# EAGLE design alfred_v2 (EAGLE 6.5.0)
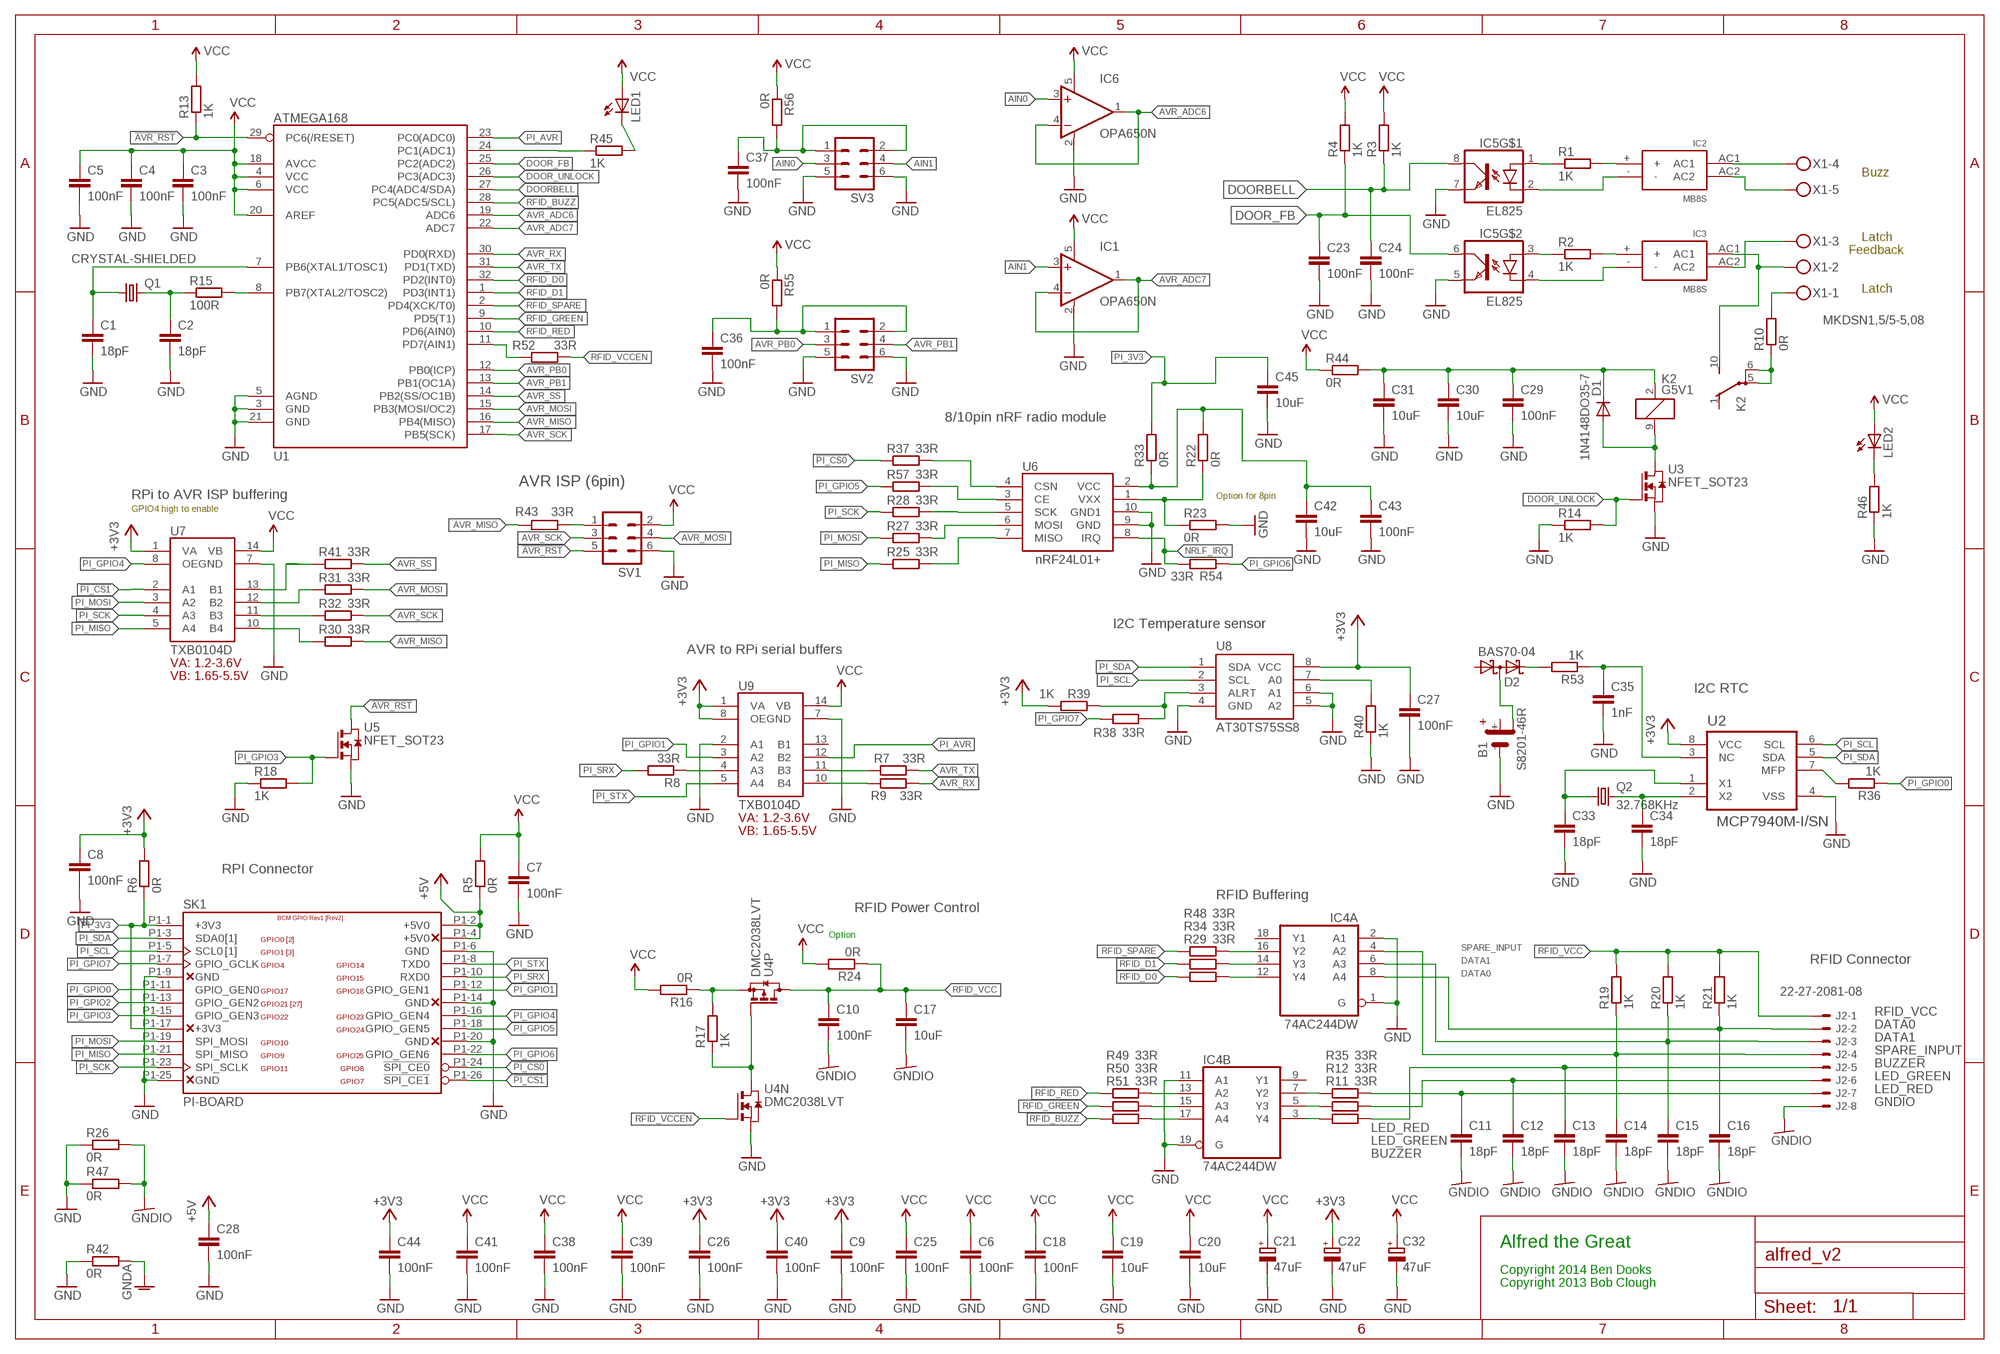
[diagram p0: schematic, sheet 1]

## Parts
B1  S8201-46R  [S8201-46R]
C1  18pF  C-EUC0603K  [C0603K]
C2  18pF  C-EUC0603K  [C0603K]
C3  100nF  C-EUC0603K  [C0603K]
C4  100nF  C-EUC0603K  [C0603K]
C5  100nF  C-EUC0603K  [C0603K]
C6  100nF  C-EUC0603K  [C0603K]
C7  100nF  C-EUC0603K  [C0603K]
C8  100nF  C-EUC0603K  [C0603K]
C9  100nF  C-EUC0603K  [C0603K]
C10  100nF  C-EUC0603K  [C0603K]
C11  18pF  C-EUC0603K  [C0603K]
C12  18pF  C-EUC0603K  [C0603K]
C13  18pF  C-EUC0603K  [C0603K]
C14  18pF  C-EUC0603K  [C0603K]
C15  18pF  C-EUC0603K  [C0603K]
C16  18pF  C-EUC0603K  [C0603K]
C17  10uF  C-EUC0805K  [C0805K]
C18  100nF  C-EUC0603K  [C0603K]
C19  10uF  C-EUC0805K  [C0805K]
C20  10uF  C-EUC0805K  [C0805K]
C21  47uF  CPOL-EUE2.5-7  [E2,5-7]
C22  47uF  CPOL-EUE2.5-7  [E2,5-7]
C23  100nF  C-EUC0603K  [C0603K]
C24  100nF  C-EUC0603K  [C0603K]
C25  100nF  C-EUC0603K  [C0603K]
C26  100nF  C-EUC0603K  [C0603K]
C27  100nF  C-EUC0603K  [C0603K]
C28  100nF  C-EUC0603K  [C0603K]
C29  100nF  C-EUC0603K  [C0603K]
C30  10uF  C-EUC0805K  [C0805K]
C31  10uF  C-EUC0805K  [C0805K]
C32  47uF  CPOL-EUE2.5-7  [E2,5-7]
C33  18pF  C-EUC0603K  [C0603K]
C34  18pF  C-EUC0603K  [C0603K]
C35  1nF  C-EUC0603K  [C0603K]
C36  100nF  C-EUC0603K  [C0603K]
C37  100nF  C-EUC0603K  [C0603K]
C38  100nF  C-EUC0603K  [C0603K]
C39  100nF  C-EUC0603K  [C0603K]
C40  100nF  C-EUC0603K  [C0603K]
C41  100nF  C-EUC0603K  [C0603K]
C42  10uF  C-EUC0805K  [C0805K]
C43  100nF  C-EUC0603K  [C0603K]
C44  100nF  C-EUC0603K  [C0603K]
C45  10uF  C-EUC0805K  [C0805K]
D1  1N4148DO35-7  [DO35-7]
D2  BAS70-04  [SOT23]
IC1  OPA650N  [SOT23-5]
IC2  MB8S  [MB8S]
IC3  MB8S  [MB8S]
IC4  74AC244DW  [SO20W]
IC5  EL825  [DIL08]
IC6  OPA650N  [SOT23-5]
J2  22-27-2081-08  [6410-08]
K2  G5V1  [G5V1]
LED1  LEDSML0805  [SML0805]
LED2  LEDSML0805  [SML0805]
Q1  CRYSTAL-SHIELDED  [SMX4]
Q2  32.768KHz  CRYSTALTC26H  [TC26H]
R1  1K  R-EU_R0603  [R0603]
R2  1K  R-EU_R0603  [R0603]
R3  1K  R-EU_R0603  [R0603]
R4  1K  R-EU_R0603  [R0603]
R5  0R  R-EU_R0603  [R0603]
R6  0R  R-EU_R0603  [R0603]
R7  33R  R-EU_R0603  [R0603]
R8  33R  R-EU_R0603  [R0603]
R9  33R  R-EU_R0603  [R0603]
R10  0R  R-EU_R0603  [R0603]
R11  33R  R-EU_R0603  [R0603]
R12  33R  R-EU_0204/5  [0204/5]
R13  1K  R-EU_R0603  [R0603]
R14  1K  R-EU_R0603  [R0603]
R15  100R  R-EU_R0603  [R0603]
R16  0R  R-EU_R0603  [R0603]
R17  1K  R-EU_R0603  [R0603]
R18  1K  R-EU_R0603  [R0603]
R19  1K  R-EU_0204/5  [0204/5]
R20  1K  R-EU_0204/5  [0204/5]
R21  1K  R-EU_0204/5  [0204/5]
R22  0R  R-EU_R0603  [R0603]
R23  0R  R-EU_R0603  [R0603]
R24  0R  R-EU_R0603  [R0603]
R25  33R  R-EU_R0603  [R0603]
R26  0R  R-EU_R0603  [R0603]
R27  33R  R-EU_R0603  [R0603]
R28  33R  R-EU_R0603  [R0603]
R29  33R  R-EU_0207/12  [0207/12]
R30  33R  R-EU_R0603  [R0603]
R31  33R  R-EU_R0603  [R0603]
R32  33R  R-EU_R0603  [R0603]
R33  0R  R-EU_R0603  [R0603]
R34  33R  R-EU_0207/12  [0207/12]
R35  33R  R-EU_0204/5  [0204/5]
R36  1K  R-EU_R0603  [R0603]
R37  33R  R-EU_R0603  [R0603]
R38  33R  R-EU_R0603  [R0603]
R39  1K  R-EU_R0603  [R0603]
R40  1K  R-EU_R0603  [R0603]
R41  33R  R-EU_R0603  [R0603]
R42  0R  R-EU_R0603  [R0603]
R43  33R  R-EU_R0603  [R0603]
R44  0R  R-EU_R0603  [R0603]
R45  1K  R-EU_R0603  [R0603]
R46  1K  R-EU_R0603  [R0603]
R47  0R  R-EU_R0603  [R0603]
R48  33R  R-EU_0207/12  [0207/12]
R49  33R  R-EU_0207/12  [0207/12]
R50  33R  R-EU_0207/12  [0207/12]
R51  33R  R-EU_0207/12  [0207/12]
R52  33R  R-EU_0207/12  [0207/12]
R53  1K  R-EU_R0603  [R0603]
R54  33R  R-EU_R0603  [R0603]
R55  0R  R-EU_R0603  [R0603]
R56  0R  R-EU_R0603  [R0603]
R57  33R  R-EU_R0603  [R0603]
SK1  PI-BOARD  [RASPBERRY-PI]
SV1  MA03-2  [MA03-2]
SV2  MA03-2  [MA03-2]
SV3  MA03-2  [MA03-2]
U1  ATMEGA168  [TQFP32-08]
U2  MCP7940M-I/SN  [SOIC127P600X175-8N]
U3  NFET_SOT23  [SOT23]
U4  DMC2038LVT  [TSOT26]
U5  NFET_SOT23  [SOT23]
U6  NRF24L01+CHINESE-10PIN  [CHINESE-10PIN]
U7  TXB0104D  [SO-14]
U8  AT30TS75SS8  [SOIC8]
U9  TXB0104D  [SO-14]
X1  MKDSN1,5/5-5,08  [MKDSN1,5/5-5,08]

## Nets
!AVR_RST: R13.1 SV1.5 U1.29(PC6(/RESET)) U5.3(D)
!NRLF_CE: R57.2 U6.3(CE)
!NRLF_CS: R37.2 U6.4(CSN)
!PI_CS0: R37.1 SK1.P1-24(!SPI_CE0)
!PI_CS1: SK1.P1-26(!SPI_CE1) U7.2(A1)
+3V3: C8.1 C9.1 C22.+ C26.1 C27.1 C40.1 C44.1 R6.2 R39.1 U2.8(VCC) U7.1(VA) U8.8(VCC) U9.1(VA) U9.8(OE)
+5V: C28.1 R5.1 SK1.P1-2(+5V0) SK1.P1-4(+5V0)
AIN0: IC6.3(+IN) SV3.3
AIN1: IC1.3(+IN) SV3.4
AVR_ADC6: IC6.1(OUT) IC6.4(-IN) U1.19(ADC6)
AVR_ADC7: IC1.1(OUT) IC1.4(-IN) U1.22(ADC7)
AVR_MISO: R30.2 R43.1 U1.16(PB4(MISO))
AVR_MOSI: R31.2 SV1.4 U1.15(PB3(MOSI/OC2))
AVR_PB0: SV2.3 U1.12(PB0(ICP))
AVR_PB1: SV2.4 U1.13(PB1(OC1A))
AVR_RX: R9.2 U1.30(PD0(RXD))
AVR_SCK: R32.2 SV1.3 U1.17(PB5(SCK))
AVR_SS: R41.2 U1.14(PB2(SS/OC1B))
AVR_TX: R7.2 U1.31(PD1(TXD))
BUZZER: C13.1 J2.5 R11.2
DATA0: C16.1 IC4.8(A:A4) J2.2 R21.1
DATA1: C15.1 IC4.6(A:A3) J2.3 R20.1
DOOR_FB: C23.1 IC5.6(COL) R4.1 U1.25(PC2(ADC2))
DOOR_UNLOCK: R14.2 U1.26(PC3(ADC3)) U3.1(G)
DOORBELL: C24.1 IC5.8(COL) R3.1 U1.27(PC4(ADC4/SDA))
GND: B1.- C1.2 C2.2 C3.2 C4.2 C5.2 C6.2 C7.2 C8.2 C9.2 C18.2 C19.2 C20.2 C21.- C22.- C23.2 C24.2 C25.2 C26.2 C27.2 C28.2 C29.2 C30.2 C31.2 C32.- C33.2 C34.2 C35.2 C36.2 C37.2 C38.2 C39.2 C40.2 C41.2 C42.2 C43.2 C44.2 C45.2 IC1.2(V-) IC4.1(A:G) IC4.2(A:A1) IC4.11(B:A1) IC4.19(B:G) IC5.5(EMIT) IC5.7(EMIT) IC6.2(V-) R14.1 R18.1 R23.2 R26.1 R40.1 R42.1 R46.1 R47.1 SK1.P1-6(GND) SK1.P1-9(GND) SK1.P1-14(GND) SK1.P1-20(GND) SK1.P1-25(GND) SV1.6 SV2.5 SV2.6 SV3.5 SV3.6 U1.3(GND) U1.5(AGND) U1.21(GND) U2.4(VSS) U3.2(S) U4.5(N:S) U5.2(S) U6.9(GND) U6.10(GND1) U7.7(GND) U8.4(GND) U8.5(A2) U8.6(A1) U9.2(A1) U9.7(GND)
GNDA: R42.2
GNDIO: C10.2 C11.2 C12.2 C13.2 C14.2 C15.2 C16.2 C17.2 J2.8 R26.2 R47.2
LED_GREEN: C12.1 J2.6 R12.2
LED_RED: C11.1 J2.7 R35.2
N$1: IC5.1(A) R1.1
N$2: IC2.- IC5.2(C)
N$3: IC2.+ R1.2
N$4: IC2.AC1 X1.4
N$5: IC2.AC2 X1.5
N$6: IC5.3(A) R2.1
N$7: IC3.+ R2.2
N$8: IC3.- IC5.4(C)
N$9: IC3.AC2 X1.3
N$10: R15.2 U1.8(PB7(XTAL2/TOSC2))
N$11: C1.1 Q1.3 U1.7(PB6(XTAL1/TOSC1))
N$12: C2.1 Q1.1 R15.1
N$13: IC3.AC1 K2.10(2:S) X1.2
N$14: R8.1 U9.4(A3)
N$15: R10.2 X1.1
N$16: D1.A K2.9 U3.3(D)
N$17: IC4.16(A:Y2) R48.2
N$18: K2.5(2:P) K2.6(2:P) R10.1
N$19: C35.1 R53.1 U2.3(NC)
N$20: D2.2(C2) R53.2
N$21: R43.2 SV1.1
N$22: R52.1 U1.11(PD7(AIN1))
N$23: B1.+1(+2) D2.3(C1A2)
N$24: IC4.14(A:Y3) R34.2
N$25: R30.1 U7.10(B4)
N$26: R36.2 U2.7(MFP)
N$27: R25.2 U6.7(MISO)
N$28: R38.2 R39.2 U8.3(ALRT)
N$29: R27.2 U6.6(MOSI)
N$30: R28.2 U6.5(SCK)
N$31: IC4.12(A:Y4) R29.2
N$32: IC4.17(B:A4) R51.2
N$33: R41.1 U7.13(B1)
N$35: C29.1 C30.1 C31.1 D1.C K2.2 R44.2
N$36: C33.1 Q2.1 U2.1(X1)
N$37: R45.1 U1.24(PC1(ADC1))
N$38: LED1.C R45.2
N$39: LED2.C R46.2
N$40: C34.1 Q2.2 U2.2(X2)
N$41: IC4.15(B:A3) R50.2
N$42: IC4.13(B:A2) R49.2
N$43: C36.1 R55.2 SV2.1 SV2.2
N$46: C37.1 R56.2 SV3.1 SV3.2
NRLF_IRQ: R54.2 U6.8(IRQ)
PI_3V3: C45.1 R6.1 R33.2 SK1.P1-1(+3V3) SK1.P1-17(+3V3)
PI_AVR: U1.23(PC0(ADC0)) U9.12(B2)
PI_GPIO0: R36.1 SK1.P1-11(GPIO_GEN0)
PI_GPIO1: SK1.P1-12(GPIO_GEN1) U9.3(A2)
PI_GPIO2: SK1.P1-13(GPIO_GEN2)
PI_GPIO3: R18.2 SK1.P1-15(GPIO_GEN3) U5.1(G)
PI_GPIO4: SK1.P1-16(GPIO_GEN4) U7.8(OE)
PI_GPIO5: R57.1 SK1.P1-18(GPIO_GEN5)
PI_GPIO6: R54.1 SK1.P1-22(GPIO_GEN6)
PI_GPIO7: R38.1 SK1.P1-7(GPIO_GCLK)
PI_MISO: R25.1 SK1.P1-21(SPI_MISO) U7.5(A4)
PI_MOSI: R27.1 SK1.P1-19(SPI_MOSI) U7.3(A2)
PI_SCK: R28.1 SK1.P1-23(SPI_SCLK) U7.4(A3)
PI_SCL: SK1.P1-5(SCL0) U2.6(SCL) U8.2(SCL)
PI_SDA: SK1.P1-3(SDA0) U2.5(SDA) U8.1(SDA)
PI_SRX: R8.2 SK1.P1-10(RXD0)
PI_STX: SK1.P1-8(TXD0) U9.5(A4)
R_BUZZER: IC4.3(B:Y4) R11.1
R_GREEN: IC4.5(B:Y3) R12.1
R_RED: IC4.7(B:Y2) R35.1
RF_VCC: C42.1 C43.1 R22.2 R33.1 U6.2(VCC)
RF_VXX: R22.1 R23.1 U6.1(VXX)
RFID_BUZZ: R51.1 U1.28(PC5(ADC5/SCL))
RFID_D0: R29.1 U1.32(PD2(INT0))
RFID_D1: R34.1 U1.1(PD3(INT1))
RFID_GREEN: R50.1 U1.9(PD5(T1))
RFID_RED: R49.1 U1.10(PD6(AIN0))
RFID_SPARE: R48.1 U1.2(PD4(XCK/T0))
RFID_SW: R17.1 U4.3(P:G) U4.6(N:D)
RFID_VCC: C10.1 C17.1 J2.1 R19.2 R20.2 R21.2 R24.1 U4.4(P:D)
RFID_VCCEN: R52.2 U4.1(N:G)
RFID_VCCSU: R16.1 R17.2 U4.2(P:S)
S_RX: R7.1 U9.11(B3)
S_RX1: R32.1 U7.11(B3)
S_TX: R9.1 U9.10(B4)
S_TX1: R31.1 U7.12(B2)
SPARE_INPUT: C14.1 IC4.4(A:A2) J2.4 R19.1
TMP_A0: R40.2 U8.7(A0)
VCC: C3.1 C4.1 C5.1 C6.1 C7.1 C18.1 C19.1 C20.1 C21.+ C25.1 C32.+ C38.1 C39.1 C41.1 IC1.5(V+) IC6.5(V+) LED1.A LED2.A R3.2 R4.2 R5.2 R13.2 R16.2 R24.2 R44.1 R55.1 R56.1 SV1.2 U1.4(VCC) U1.6(VCC) U1.18(AVCC) U1.20(AREF) U7.14(VB) U9.14(VB)
Unconnected: B1.+ D2.1(A1) IC4.9(B:Y1) IC4.18(A:Y1) K2.1(2:O) U9.13(B1)

## Notes on the sheet
- Buzz
- Latch
- Feedback
- Latch
- 8/10pin nRF radio module
- AVR ISP (6pin)
- RPi to AVR ISP buffering | Option for 8pin
- GPIO4 high to enable
- I2C Temperature sensor
- AVR to RPi serial buffers
- I2C RTC
- RPI Connector
- RFID Buffering
- RFID Power Control
- Option
- RFID Connector
- Alfred the Great
- Copyright 2014 Ben Dooks
- Copyright 2013 Bob Clough

## Power pins joined to a net without a drawn wire
GND: IC4.10(P:GND) Q1.2(GND) Q1.4(GND)
VCC: IC4.20(P:VCC)

## Library data of the parts
B1 = bjd-harwin-s8201-46r:S8201-46R
C1-C16 C18 C23-C29 C33-C41 C43 C44 = rcl:C-EU: CAPACITOR, European symbol
C17 C19 C20 C30 C31 C42 C45 = resistor:C-EU: CAPACITOR, European symbol
C21 C22 C32 = rcl:CPOL-EU: POLARIZED CAPACITOR, European symbol
D1 = diode:1N4148: DIODE high speed (Philips)
D2 = diode:BAS70-04: Silicon Schottky Diodes General-purpose diode for high-speed switching
IC1 IC6 = burr-brown:OPA650: Operational Amplifier Wideband, Low Power, Voltage Feedback; OC_FARNELL: unknown; OC_NEWARK: unknown
IC2 IC3 = bjd-multicomp-mb8s:MB8S
IC4 = 74xx-eu:74*244: Octal BUFFER and LINE DRIVER, 3-state
IC5 = bjd-opto-el825:EL825
J2 = con-molex:22-?-08: CONNECTOR wire to board 2.54 mm (.1 inch) pitch header; OC_FARNELL: unknown; OC_NEWARK: unknown
K2 = relay:G5V1: RELAY 1 x switch, 0.5 A/125 V AC, 1 A/24 V DC , Omron; MPN: G5V-1-DC24; OC_FARNELL: 9949593; OC_NEWARK: 36M6377
LED1 LED2 = led:LED: LED OSRAM: - CHIPLED LG R971, LG N971, LY N971, LG Q971, LY Q971, LO R971, LY R971 LH N974, LH R974 LS Q976, LO Q976, LY Q976 LO Q996 - Hyper CHIPLED LW Q18S LB Q993, LB Q99A, LB R99A - SideLED LS A670, LO A670, LY A670, LG A670, LP A670 LB A673, LV A673, LT A673, LW A673 LH A674 LY A675 LS A676, LA A676, LO A676, LY A676, LW A676 LS A679, LY A679, LG A679 - Hyper Micro SIDELED® LS Y876, LA Y876, LO Y876, LY Y876 LT Y87S - SmartLED LW L88C, LW L88S LB L89C, LB L89S, LG L890 LS L89K, LO L89K, LY L89K LS L896, LA L896, LO L896, LY L896 - TOPLED LS T670, LO T670, LY T670, LG T670, LP T670 LSG T670, LSP T670, LSY T670, LOP T670, LYG T670 LG T671, LOG T671, LSG T671 LB T673, LV T673, LT T673, LW T673 LH T674 LS T676, LA T676, LO T676, LY T676, LB T676, LH T676, LSB T676, LW T676 LB T67C, LV T67C, LT T67C, LS T67K, LO T67K, LY T67K, LW E67C LS E67B, LA E67B, LO E67B, LY E67B, LB E67C, LV E67C, LT E67C LW T67C LS T679, LY T679, LG T679 LS T770, LO T770, LY T770, LG T770, LP T770 LB T773, LV T773, LT T773, LW T773 LH T774 LS E675, LA E675, LY E675, LS T675 LS T776, LA T776, LO T776, LY T776, LB T776 LHGB T686 LT T68C, LB T68C - Hyper Mini TOPLED® LB M676 - Mini TOPLED Santana® LG M470 LS M47K, LO M47K, LY M47K Source: http://www.osram.convergy.de LUXEON: - LUMILED® LXK2-PW12-R00, LXK2-PW12-S00, LXK2-PW14-U00, LXK2-PW14-V00 LXK2-PM12-R00, LXK2-PM12-S00, LXK2-PM14-U00 LXK2-PE12-Q00, LXK2-PE12-R00, LXK2-PE12-S00, LXK2-PE14-T00, LXK2-PE14-U00 LXK2-PB12-K00, LXK2-PB12-L00, LXK2-PB12-M00, LXK2-PB14-N00, LXK2-PB14-P00, LXK2-PB14-Q00 LXK2-PR12-L00, LXK2-PR12-M00, LXK2-PR14-Q00, LXK2-PR14-R00 LXK2-PD12-Q00, LXK2-PD12-R00, LXK2-PD12-S00 LXK2-PH12-R00, LXK2-PH12-S00 LXK2-PL12-P00, LXK2-PL12-Q00, LXK2-PL12-R00 Source: www.luxeon.com KINGBRIGHT: KA-3528ASYC Source: www.kingbright.com
Q1 = bjd-crystals:CRYSTAL-SHIELDED
Q2 = crystal:CRYSTAL: CRYSTAL; OC_FARNELL: unknown; OC_NEWARK: unknown
R1-R57 = rcl:R-EU_: RESISTOR, European symbol
SK1 = jt-raspberry-pi:PI-: Raspberry Pi
SV1-SV3 = con-lstb:MA03-2: PIN HEADER; OC_FARNELL: unknown; OC_NEWARK: unknown
U1 = SparkFun:ATMEGA168
U2 = mcp7940m:MCP7940M-I/SN: RTC, I2C, 64BYTES SRAM, 8SOIC; MPN: MCP7940M-I/SN; OC_FARNELL: 2098890; OC_NEWARK: 79T6324; PACKAGE: SOIC-8; SUPPLIER: Microchip
U3 U5 = bjd-generic-fets:NFET_SOT23
U4 = bjd-diodes-dmc2038lvt:DMC2038LVT: DMC2038LVT N-P complementary FET See http://www.diodes.com/datasheets/DMC2038LVT.pdf
U6 = bjd-nrlf24+:NRF24L01+: When using the DUAL version of this library, make sure to connect VXX to either GND or NC
U7 U9 = bjd-txb0104:TXB0104
U8 = bjd-atmel-at30ts75:AT30TS75
X1 = con-phoenix-508:MKDSN1,5/5-5,08: MKDSN 1,5/ 5-5,08 Printklemme Nennstrom: 13,5 A Nennspannung: 250 V Rastermaß: 5,08 mm Polzahl: 5 Anschlussart: Schraubanschluss Montage: Löten Anschlussrichtung Leiter/Platine: 0 ° Artikelnummer: 1729157 Source: http://eshop.phoenixcontact.com .. 1729157.pdf; MPN: SMKDSN1,5/5-5,08; OC_FARNELL: 1792906; OC_NEWARK: 70R0301

## Board
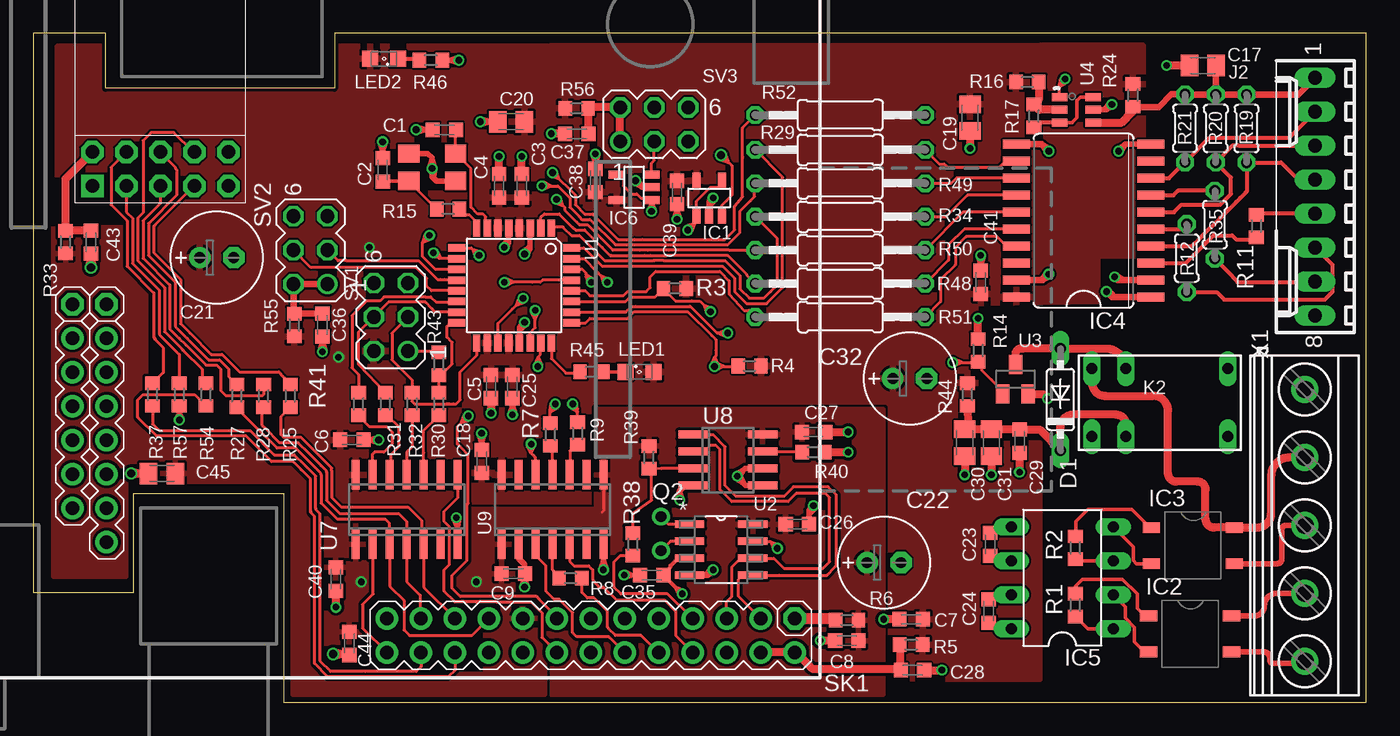
[diagram p1: board, top side]
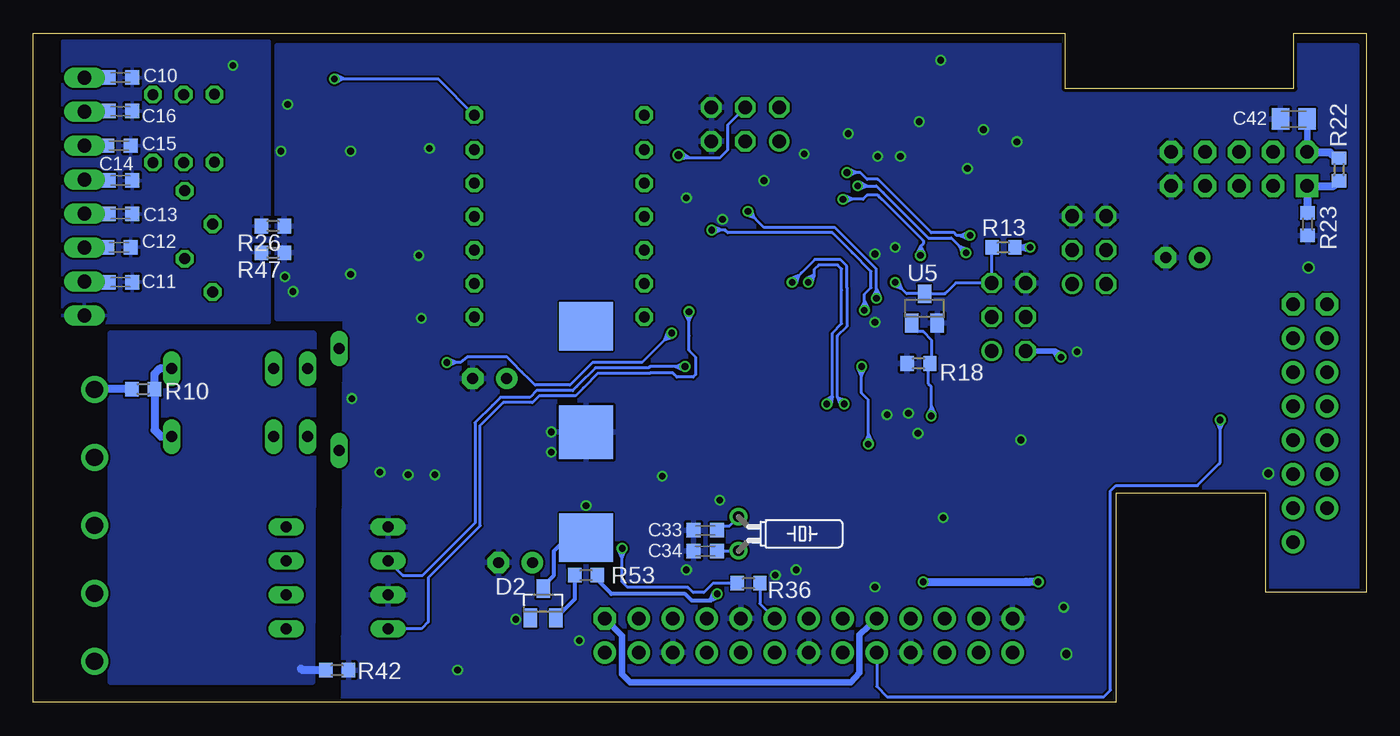
[diagram p2: board, bottom side, seen from below]

Size 99.6 x 50 mm. Coordinates in mm from the lower left corner, seen from the top.
Outline: 0,8.2 7.5,8.2 7.5,15.6 18.7,15.6 18.7,0 99.6,0 99.6,50 22.5,50 22.5,45.9 5.4,45.9 5.4,50 0,50 0,8.2
Copper layers (1*16): Top 0.035mm / dielectric 1.5mm / Bottom 0.035mm
Design rules "Elecrow_2-layer_eagle_rule *": minimum track width 6mil, minimum drill 12mil, track to track 6mil, track to pad 6mil, pad to pad 6mil, via to via 6mil, smd to smd 0mil, copper to edge 10mil, drill to drill 10mil, minimum pad ring 10mil, minimum via ring 6mil, stop-mask expansion 2mil, vias tented up to drill 100mil, thermal gap 8mil

### Footprints (pad centres in the part's own frame; a part is rotated, then mirrored left to right if it is on the bottom)
S8201-46R = smd 3.6 x 4: + -7.9,0; +1 7.9,0 | smd 4 x 4: - 0,0
C0603K = smd 1.05 x 1.08: 1 -0.875,0; 2 0.875,0
C0805K = smd 1.3 x 1.6: 1 -1,0; 2 1,0
E2,5-7 = drill 0.813 pad 1.6: + -1.27,0 | drill 0.813 pad 1.6 octagon: - 1.27,0
DO35-7 = drill 0.813 long: A 3.81,0; C -3.81,0
SOT23 = smd 1 x 1.4: 1 -0.95,-1.1; 2 0.95,-1.1; 3 0,1.1
SOT23-5 = smd 0.6 x 1.2: 1 -0.95,-1.306; 2 0,-1.306; 3 0.95,-1.306; 4 0.95,1.306; 5 -0.95,1.306
MB8S = smd 1.3 x 0.8: + -3.1,1.35; - -3.1,-1.35; AC1 3.1,1.35; AC2 3.1,-1.35
SO20W = smd 0.66 x 2.032: 1 -5.715,-5.029; 2 -4.445,-5.029; 3 -3.175,-5.029; 4 -1.905,-5.029; 5 -0.635,-5.029; 6 0.635,-5.029; 7 1.905,-5.029; 8 3.175,-5.029; 9 4.445,-5.029; 10 5.715,-5.029; 11 5.715,5.029; 12 4.445,5.029; 13 3.175,5.029; 14 1.905,5.029; 15 0.635,5.029; 16 -0.635,5.029; 17 -1.905,5.029; 18 -3.175,5.029; 19 -4.445,5.029; 20 -5.715,5.029
DIL08 = drill 0.813 long: 1 -3.81,-3.81; 2 -1.27,-3.81; 3 1.27,-3.81; 4 3.81,-3.81; 5 3.81,3.81; 6 1.27,3.81; 7 -1.27,3.81; 8 -3.81,3.81
6410-08 = drill 1.016 long: 1 8.89,0; 2 6.35,0; 3 3.81,0; 4 1.27,0; 5 -1.27,0; 6 -3.81,0; 7 -6.35,0; 8 -8.89,0
G5V1 = drill 0.813 long: 1 -5.08,-2.54; 2 -2.54,-2.54; 5 5.08,-2.54; 6 5.08,2.54; 9 -2.54,2.54; 10 -5.08,2.54
SML0805 = smd 1.2 x 1.2: A 1.05,0; C -1.05,0
SMX4 = smd 1.6 x 1.35: 1 1.75,1.025; 2 -1.75,1.025; 3 -1.75,-1.025; 4 1.75,-1.025
TC26H = drill 0.813: 1 -1.27,0; 2 1.27,0
R0603 = smd 1 x 1.1: 1 -0.85,0; 2 0.85,0
0204/5 = drill 0.813 octagon: 1 -2.54,0; 2 2.54,0
0207/12 = drill 0.813 octagon: 1 -6.35,0; 2 6.35,0
RASPBERRY-PI = drill 1.016 pad 1.676 octagon: P1-1 1.905,51.435; P2-1 53.34,27.94; P3-1 55.88,27.94 | drill 1.016 pad 1.676: P1-2 1.905,53.975; P1-3 4.445,51.435; P1-4 4.445,53.975; P1-5 6.985,51.435; P1-6 6.985,53.975; P1-7 9.525,51.435; P1-8 9.525,53.975; P1-9 12.065,51.435; P1-10 12.065,53.975; P1-11 14.605,51.435; P1-12 14.605,53.975; P1-13 17.145,51.435; P1-14 17.145,53.975; P1-15 19.685,51.435; P1-16 19.685,53.975; P1-17 22.225,51.435; P1-18 22.225,53.975; P1-19 24.765,51.435; P1-20 24.765,53.975; P1-21 27.305,51.435; P1-22 27.305,53.975; P1-23 29.845,51.435; P1-24 29.845,53.975; P1-25 32.385,51.435; P1-26 32.385,53.975; P2-2 53.34,30.48; P2-3 53.34,33.02; P2-4 53.34,35.56; P2-5 53.34,38.1; P2-6 53.34,40.64; P2-7 53.34,43.18; P2-8 53.34,45.72; P3-2 55.88,30.48; P3-3 55.88,33.02; P3-4 55.88,35.56; P3-5 55.88,38.1; P3-6 55.88,40.64; P3-7 55.88,43.18
MA03-2 = drill 1.016: 1 -2.54,-1.27 | drill 1.016 octagon: 2 -2.54,1.27; 3 0,-1.27; 4 0,1.27; 5 2.54,-1.27; 6 2.54,1.27
TQFP32-08 = smd 1.27 x 0.559: 1 -4.293,2.8; 2 -4.293,2; 3 -4.293,1.2; 4 -4.293,0.4; 5 -4.293,-0.4; 6 -4.293,-1.2; 7 -4.293,-2; 8 -4.293,-2.8; 17 4.293,-2.8; 18 4.293,-2; 19 4.293,-1.2; 20 4.293,-0.4; 21 4.293,0.4; 22 4.293,1.2; 23 4.293,2; 24 4.293,2.8 | smd 0.559 x 1.27: 9 -2.8,-4.293; 10 -2,-4.293; 11 -1.2,-4.293; 12 -0.4,-4.293; 13 0.4,-4.293; 14 1.2,-4.293; 15 2,-4.293; 16 2.8,-4.293; 25 2.8,4.293; 26 2,4.293; 27 1.2,4.293; 28 0.4,4.293; 29 -0.4,4.293; 30 -1.2,4.293; 31 -2,4.293; 32 -2.8,4.293
SOIC127P600X175-8N = smd 2.184 x 0.559: 1 -2.362,1.905; 2 -2.362,0.635; 3 -2.362,-0.635; 4 -2.362,-1.905; 5 2.362,-1.905; 6 2.362,-0.635; 7 2.362,0.635; 8 2.362,1.905
TSOT26 = smd 0.6 x 1.15: 1 -0.95,-1.25; 2 0,-1.25; 3 0.95,-1.25; 4 0.95,1.25; 5 0,1.25; 6 -0.95,1.25
CHINESE-10PIN = drill 1 pad 1.676 square: 1 -1.27,2.54 | drill 1 pad 1.676 octagon: 2 1.27,2.54; 3 -1.27,0; 4 1.27,0; 5 -1.27,-2.54; 6 1.27,-2.54; 7 -1.27,-5.08; 8 1.27,-5.08; 9 -1.27,-7.62; 10 1.27,-7.62
SO-14 = smd 0.6 x 2.2: 1 -3.81,-2.6; 2 -2.54,-2.6; 3 -1.27,-2.6; 4 0,-2.6; 5 1.27,-2.6; 6 2.54,-2.6; 7 3.81,-2.6; 8 3.81,2.6; 9 2.54,2.6; 10 1.27,2.6; 11 0,2.6; 12 -1.27,2.6; 13 -2.54,2.6; 14 -3.81,2.6
SOIC8 = smd 0.6 x 2.2: 1 -1.905,-2.6; 2 -0.635,-2.6; 3 0.635,-2.6; 4 1.905,-2.6; 5 1.905,2.6; 6 0.635,2.6; 7 -0.635,2.6; 8 -1.905,2.6
MKDSN1,5/5-5,08 = drill 1.3 pad 2: 1 -10.181,0.025; 2 -5.101,0.025; 3 -0.021,0.025; 4 5.059,0.025; 5 10.139,0.025

### Placement (x,y rotation side)
B1  58.3,20.2 270 bottom
C1  30.7,42.8 180 top
C2  26.1,39.8 90 top
C3  36.5,38.6 90 top
C4  34.8,38.6 90 top
C5  34.2,23.6 270 top
C6  23.81,19.61 0 top
C7  65.6,6.2 180 top
C8  60.8,4.6 180 top
C9  35.86,9.61 0 top
C10  93.09,46.7 0 bottom
C11  93.1,31.41 0 bottom
C12  93.2,34.01 0 bottom
C13  93.1,36.51 0 bottom
C14  93.1,39.01 0 bottom
C15  93.2,41.61 0 bottom
C16  93.1,44.19 0 bottom
C17  87.4,47.6 180 top
C18  33.5,18 90 top
C19  70,43.7 270 top
C20  35.7,43.4 180 top
C21  13.7,33.24 0 top
C22  63.57,10.44 0 top
C23  71.5,11.8 90 top
C24  71.4,6.8 90 top
C25  35.8,23.6 270 top
C26  57.1,13.3 0 top
C27  58.3,20.2 0 top
C28  65.7,2.4 0 top
C29  73.7,19.5 270 top
C30  69.6,19.4 270 top
C31  71.6,19.4 270 top
C32  65.5,24.2 0 top
C33  49.4,12.85 180 bottom
C34  49.4,11.3 180 bottom
C35  46.2,9.5 180 top
C36  21.6,28.2 270 top
C37  40.6,42.5 180 top
C38  42,39 90 top
C39  48.1,38.1 270 top
C40  22.6,9.2 270 top
C41  70.8,31.4 90 top
C42  5.4,43.6 180 bottom
C43  4.3,34.4 270 top
C44  23.6,4.4 270 top
C45  9.6,17.1 180 top
D1  76.76,22.63 90 top
D2  61.5,7.4 0 bottom
IC1  50.5,37.7 0 top
IC2  86.44,5.11 0 top
IC3  86.65,11.71 0 top
IC4  78.49,36 90 top
IC5  76.9,9.3 90 top
IC6  44.9,38.5 90 top
J2  95.8,37.8 90 top
K2  84.2,22.4 0 top
LED1  45.3,24.7 0 top
LED2  26.2,48.1 180 top
Q1  29.8,40 180 top
Q2  46.9,12.6 270 bottom
R1  77.87,7.26 90 top
R2  77.87,11.55 90 top
R3  47.94,30.93 0 top
R4  53.53,25.13 0 top
R5  65.6,4.3 0 top
R6  60.81,6.13 0 top
R7  38.63,20.01 90 top
R8  40.13,9.27 0 top
R9  40.67,20.09 90 top
R10  91.4,23.4 180 bottom
R11  91.4,35.6 90 top
R12  86.2,33.2 270 top
R13  27.1,34 0 bottom
R14  70.6,26.3 270 top
R15  30.99,36.87 0 top
R16  74.29,46.37 180 top
R17  74.77,43.83 90 top
R18  33.45,25.33 0 bottom
R19  90.67,42.89 90 top
R20  88.37,42.89 90 top
R21  86.07,42.91 90 top
R22  2.03,39.83 90 bottom
R23  4.37,35.75 270 bottom
R24  82.17,45.37 90 top
R25  19.2,22.9 90 top
R26  81.7,35.6 180 bottom
R27  15.2,22.9 90 top
R28  17.2,22.9 90 top
R29  60.3,41.3 0 top
R30  30.3,22.3 90 top
R31  26.3,22.3 90 top
R32  28.3,22.3 90 top
R33  2.4,34.4 270 top
R34  60.3,36.3 0 top
R35  88.3,35.7 270 top
R36  46.15,8.9 180 bottom
R37  8.9,23 90 top
R38  44.8,11.8 90 top
R39  46,18.3 270 top
R40  58.3,18.7 180 top
R41  24.3,22.3 90 top
R42  76.9,2.4 180 bottom
R43  30.3,25.3 90 top
R44  69.8,23 270 top
R45  41.7,24.7 0 top
R46  29.7,48 180 top
R47  81.7,33.6 180 bottom
R48  60.3,31.3 0 top
R49  60.3,38.8 0 top
R50  60.3,33.8 0 top
R51  60.3,28.8 0 top
R52  60.3,43.9 0 top
R53  58.3,9.5 180 bottom
R54  12.9,23 90 top
R55  19.5,28.2 90 top
R56  40.6,44.4 0 top
R57  10.9,23 90 top
SK1  58.8,57.7 180 top
SV1  26.7,28.8 90 top
SV2  20.7,33.8 90 top
SV3  46.4,43.2 0 top
U1  35.92,31.16 270 top
U2  51.4,11.4 0 top
U3  73.4,24.14 0 top
U4  77.94,44.29 270 top
U5  33,29.44 0 bottom
U6  6.94,39.86 90 top
U7  27.9,14.4 0 top
U8  51.9,18.1 270 top
U9  38.8,14.4 0 top
X1  95,13.2 270 top

### Tracks (layer width: path | path; a pad name or v marks a point on that pad's centre or on a via)
!AVR_RST  (via drill 0.5)
  Top 0.208: v35.2,31.4 37.3,31.4 37.9,31.4 38.06,31.56 U1.29 | v35.2,31.4 35.33,31.67 35.9,31.4 35.33,31.13 v35.2,31.4
  Bottom 0.208: R13.1 27.97,33.26 SV1.5 30.66,31.34 31.3,30.7 31.46,30.54 U5.3 34.34,30.54 v35.2,31.4 | v35.2,31.4 35.3,31.12 34.7,30.91 34.92,31.5 v35.2,31.4
!NRLF_CE
  Top 0.208: U6.3 6.94,36.66 7.4,36.2 7.4,32.8 9.4,30.8 9.4,27.5 10.9,26 R57.2
!NRLF_CS
  Top 0.208: U6.4 6,40.2 5.8,40 5.8,37.2 7,36 7,32.6 9,30.6 9,27.3 9.1,27.1 9.7,26.5 9.7,24.65 R37.2
!PI_CS0
  Top 0.208: SK1.P1-24 28.95,2.65 28.6,2.3 24.8,2.3 22.2,2.3 21.4,3.1 21.4,14.1 21.1,14.4 21.1,14.5 21.1,16.9 20.4,17.6 20.2,17.8 19.5,18.5 18,18.5 16.2,20.3 15.8,20.3 9.4,20.3 9.2,20.5 8.9,20.8 R37.1
!PI_CS1
  Top 0.208: U7.2 25.4,11.76 25.4,8.1 24.6,7.3 24.6,5.54 SK1.P1-26
+3V3  (via drill 0.5)
  Top 0.208: U9.8 42.61,14.31 42.5,14.2
  Top 0.61: 33.21,9.11 v33.1,9
  Bottom 0.61: v24.5,9 24.7,9 25.1,9 25.4,9 v33.1,9
  pour Top (isolate 0.22, rank 2): 63.5,0.6 0.3,0.6 0.4,18.2 19.7,18.2 19.7,17.9 21.7,17.9 21.7,14.4 42.1,14.4 42.1,21.9 63.5,21.9
+5V
  Top 0.61: SK1.P1-4 SK1.P1-2 56.98,3.73 57.8,2.9 58.2,2.5 64.72,2.5 C28.1 64.77,2.46 R5.1
AIN0
  Top 0.208: IC6.3 46.21,40.31 46.4,40.5 SV3.3
AIN1  (via drill 0.6)
  Top 0.208: SV3.4 46.4,44.4 | IC1.3 51.45,37.15 51.8,37.5 52.2,37.9 52.2,40.1 51.7,40.6 v51.4,40.9 | v51.4,40.9 51.73,41.02 51.99,40.31 51.28,40.57 v51.4,40.9
  Bottom 0.208: v51.4,40.9 50.9,40.9 50.7,40.7 48.3,40.7 47.7,41.3 47.7,43.17 SV3.4 | v51.4,40.9 51.34,40.56 50.58,40.7 51.18,41.17 v51.4,40.9
AVR_ADC6  (via drill 0.5)
  Top 0.208: U1.19 34.72,28.32 35.8,29.4 36,29.6 v36.6,30.2 | v46.2,36.7 IC6.1 46.06,37.7 45.4,37.7 45.1,38 44.7,38 44.3,38.4 44.1,38.6 44.1,39.1 43.75,39.45 IC6.4 | v36.6,30.2 36.7,29.92 36.1,29.7 36.32,30.3 v36.6,30.2 | v46.2,36.7 45.93,36.83 46.2,37.4 46.47,36.83 v46.2,36.7
  Bottom 0.208: v36.6,30.2 36.6,32.4 39.1,34.9 39.7,35.5 45,35.5 v46.2,36.7 | v36.6,30.2 36.33,30.33 36.6,30.9 36.87,30.33 v36.6,30.2 | v46.2,36.7 46.3,36.42 45.7,36.2 45.92,36.8 v46.2,36.7
AVR_ADC7  (via drill 0.5)
  Top 0.208: IC1.4 51.4,38.76 51.2,38.5 50.6,38.5 49.55,37.45 IC1.1 49.5,36.34 49.5,35.9 v48.9,35.3 | U1.22 37.12,27.62 37.5,28 v37.5,29.3 | v37.5,29.3 37.77,29.17 37.5,28.6 37.23,29.17 v37.5,29.3 | v48.9,35.3 48.8,35.58 49.4,35.8 49.18,35.2 v48.9,35.3
  Bottom 0.208: v37.5,29.3 37.5,30.5 37,31 37,32.2 38.4,33.6 39.9,35.1 47.7,35.1 47.9,35.3 v48.9,35.3 | v37.5,29.3 37.23,29.43 37.5,30 37.77,29.43 v37.5,29.3 | v48.9,35.3 48.77,35.03 48.2,35.3 48.77,35.57 v48.9,35.3
AVR_MISO
  Top 0.208: R30.2 30.2,23.25 30.3,23.45 R43.1 30.45,24.45 31.3,25.3 31.3,26.9 30.9,27.3 30.9,28.1 31.1,28.3 31.57,28.3 U1.16
AVR_MOSI
  Top 0.208: 24.3,25.3 24.3,25.25 | 24.3,25.25 24.3,25.3 | 24.3,25.3 24.3,27.67 SV1.4 26.53,29.9 29.3,29.9 29.7,29.5 29.8,29.4 30,29.2 31.59,29.2 U1.15 31.57,29.1 | 24.3,25.3 24.3,25.25 | 24.3,25.25 R31.2
AVR_PB0
  Top 0.208: U1.12 31.59,31.6 30.7,31.6 30.4,31.6 30.2,31.6 29.8,32 28.8,33 24.1,33 23.4,33 22.77,33 SV2.3
AVR_PB1
  Top 0.208: U1.13 29.74,30.76 29.4,31.1 29.4,31.7 28.6,32.5 24.3,32.5 20.73,32.5 SV2.4
AVR_RX  (via drill 0.5)
  Top 0.208: R9.2 40.67,21.93 v40.3,22.3 | U1.30 40.25,32.4 41,32.4 41.3,32.1 41.3,31.8 v41.7,31.4 | v40.3,22.3 40.6,22.34 40.67,21.71 40.14,22.05 v40.3,22.3 | v41.7,31.4 41.41,31.35 41.3,31.97 41.85,31.66 v41.7,31.4
  Bottom 0.208: v40.3,22.3 39.9,22.7 39.9,27.6 39.2,28.3 39.2,30.8 39.2,32.4 39.5,32.7 40.9,32.7 41.25,32.35 41.25,31.85 v41.7,31.4 | v40.3,22.3 40.01,22.25 39.9,22.87 40.45,22.56 v40.3,22.3 | v41.7,31.4 41.41,31.32 41.25,31.94 41.83,31.67 v41.7,31.4
AVR_SCK
  Top 0.208: U1.17 33.12,25.92 31.9,24.7 31.9,22.6 31.6,22.3 31.4,22.3 30.9,22.3 | 30.9,22.3 28.5,22.3 28.3,22.5 R32.2 28.3,24.1 26.8,25.6 26.8,27.6 27.97,28.77 SV1.3 | 30.9,22.3 31.1,22.3 30.9,22.3
AVR_SS
  Top 0.208: R41.2 24.3,24.5 23.8,25 23.8,28.9 24.9,30 25.9,30 26.2,30.3 29.3,30.3 29.7,30.3 30.1,29.9 31.57,29.9 U1.14
AVR_TX  (via drill 0.5)
  Top 0.208: R7.2 38.63,21.93 v39,22.3 | 40.17,33.2 U1.31 41.14,33.16 42.1,32.2 42.2,32.1 v42.9,31.4 | v39,22.3 39.16,22.05 38.63,21.71 38.7,22.34 v39,22.3 | v42.9,31.4 42.62,31.3 42.41,31.89 43,31.68 v42.9,31.4
  Bottom 0.208: v39,22.3 39.5,22.8 39.5,27.4 38.8,28.1 38.8,31 38.8,32.6 39.3,33.1 41.2,33.1 42.55,31.75 | v42.9,31.4 42.55,31.75 | 42.55,31.75 42.2,32.1 | v39,22.3 38.9,22.58 39.49,22.8 39.28,22.2 v39,22.3 | 42.41,31.89 42.62,31.3 | v42.9,31.4 42.62,31.3 | 42.41,31.89 43,31.68 | v42.9,31.4 43,31.68 | 42.41,31.89 42.62,31.3 | v42.9,31.4 42.62,31.3 | 42.41,31.89 43,31.68 | v42.9,31.4 43,31.68
BUZZER
  Top 0.3: J2.5 91.48,36.53 R11.2
  Bottom 0.5: C13.1 95.78,36.51 J2.5
DATA0
  Top 0.3: J2.2 93.85,42.2 87.9,42.2 86.2,40.5 R21.1 84.88,39.17 IC4.8
  Top 0.5: 86.2,40.5 R21.1
  Bottom 0.406: C16.1 95.76,44.19 J2.2
DATA1
  Top 0.3: J2.3 90.1,41.6 89.62,41.6 R20.1 89.5,39.22 89.5,38 88.7,37.2 87.9,37.2 85.8,37.2 85.23,36.63 84.83,36.63 IC4.6
  Bottom 0.406: C15.1 J2.3
DOOR_FB  (via drill 0.5)
  Top 0.208: v50.9,25.1 52.65,25.1 R4.1 | U1.25 41.26,28.36 41.6,28.7 44.4,28.7 44.9,29.2 48.9,29.2 50.7,27.4 51,27.1 51,26.3 51,25.9 50.9,25.8 | IC5.6 71.86,10.57 C23.1 | 50.9,25.8 v50.9,25.1 | v50.9,25.1 51.03,25.37 51.6,25.1 51.03,24.83 v50.9,25.1 | 50.9,25.8 50.63,25.23 v50.9,25.1 | 50.9,25.8 51.17,25.23 v50.9,25.1
  Bottom 0.208: IC5.6 73.07,10.57 72,9.5 70.5,9.5 66.6,13.4 66.6,20.9 65.3,22.2 64.7,22.8 62.5,22.8 62,23.3 59.3,23.3 59,23.6 58.9,23.7 57.6,25 53.6,25 53.5,25.1 v50.9,25.1 | v50.9,25.1 51.03,25.37 51.6,25.1 51.03,24.83 v50.9,25.1
DOOR_UNLOCK  (via drill 0.5)
  Top 0.208: U3.1 72.45,23.25 71.6,24.1 70.9,24.8 70.9,25.15 R14.2 70.55,25.4 v68.7,25.4 | v51.9,27.6 51.1,27.6 49.1,29.6 49,29.6 45,29.6 44.7,29.6 44.26,29.16 | U1.26 42.04,29.16 | 42.04,29.16 44.26,29.16 | 44.26,29.16 42.04,29.16 | 42.04,29.16 44.26,29.16 | 44.26,29.16 42.04,29.16 | 42.04,29.16 44.26,29.16 | v68.7,25.4 68.83,25.67 69.4,25.4 68.83,25.13 v68.7,25.4 | v51.9,27.6 51.77,27.33 51.2,27.6 51.77,27.87 v51.9,27.6
  Bottom 0.208: v51.9,27.6 54.1,25.4 57.3,25.4 57.8,25.4 59.5,23.7 62.1,23.7 62.5,24.1 63.1,24.7 63.8,25.4 64.2,25.8 67.2,25.8 67.7,25.4 v68.7,25.4 | v68.7,25.4 68.57,25.13 68,25.4 68.57,25.67 v68.7,25.4 | v51.9,27.6 52.18,27.7 52.4,27.11 51.8,27.32 v51.9,27.6
DOORBELL  (via drill 0.5)
  Top 0.208: v50.6,29.2 49.81,29.99 49.22,30 48,30 47.09,30.91 R3.1 46.46,30.3 44.6,30.3 44.26,29.96 42.02,29.96 U1.27 | C24.1 71.58,5.92 72,5.5 72.5,5.5 IC5.8 | v50.6,29.2 50.32,29.1 50.1,29.7 50.7,29.48 v50.6,29.2
  Bottom 0.208: IC5.8 70.6,5.5 70.1,6 70.1,9.3 66.2,13.2 66.2,20.7 65.1,21.8 64.5,22.4 62.3,22.4 62.1,22.6 61.8,22.9 59.1,22.9 58.5,23.5 57.4,24.6 53.5,24.6 51.8,24.6 51.7,24.5 51.5,24.3 50.3,24.3 50.1,24.5 50.1,25.8 50.5,26.2 50.6,26.3 50.6,27.4 v50.6,29.2 | v50.6,29.2 50.87,29.07 50.6,28.5 50.33,29.07 v50.6,29.2
GND  (via drill 0.5, 0.6)
  Top 0.208: IC5.7 71.75,8.03 C24.2 | IC5.5 71.94,13.11 C23.2
  Top 0.3: C35.2 v44.15,9.5 | v44.15,9.5 44.24,9.73 44.85,9.5 44.24,9.27 v44.15,9.5
  Top 0.406: U9.7 42.61,10.99 v42.6,9.9 | U7.7 31.71,13.41 v31.6,13.8 | U8.4 48.7,16.2 48.3,15.8 | 48.3,15.8 v48.3,15.1 | U8.6 53.16,17.46 v52.6,16.9 | U8.5 53.2,16.2 v52.6,16.9 | U1.21 36.32,28.02 v36.7,28.4 | C6.2 v25.79,19.61 v25.8,19.6 | 33.58,18.98 C18.2 33.5,20.02 v33.5,20.1 | U4.5 80.19,44.29 v80.6,44.7 | R46.1 v31.8,48 | C26.2 57.98,14.32 v58.3,14.7 | C1.2 v28.6,42.8 | Q1.2 30.12,38.98 29.8,39.3 v29.8,39.9 | Q1.4 29.48,41.02 29.8,40.7 v29.8,39.9 | C2.2 v26.1,41.9 | U1.5 35.52,34.32 v35.2,34 | U1.3 37.12,33.92 v36.7,33.5 | C25.2 v35.8,21.5 | C38.2 v42,41 | IC6.2 45.5,38.5 v45,39 | IC1.2 50.5,37.4 v50.8,37.7 | C39.2 v48.1,36.1 | U9.2 36.26,10.74 36.7,10.3 36.7,9.9 | 36.7,9.9 36.7,9.45 C9.2 | 36.7,9.9 v36.7,8.6 | IC4.10 81.61,41.72 v81.1,41.2 | C41.2 v70.8,33.4 | U2.4 50.4,9.49 v50.8,9.9 | v42.6,9.9 42.41,9.96 42.61,10.6 42.79,9.96 v42.6,9.9 | v31.6,13.8 31.8,13.77 31.71,13.11 31.42,13.71 v31.6,13.8 | 48.3,15.8 48.11,15.16 v48.3,15.1 | 48.3,15.8 48.49,15.16 v48.3,15.1 | v52.6,16.9 52.51,17.07 53.09,17.39 52.77,16.8 v52.6,16.9 | v52.6,16.9 52.78,16.98 53.06,16.37 52.49,16.73 v52.6,16.9 | v36.7,28.4 36.83,28.25 36.32,27.81 36.51,28.46 v36.7,28.4 | v25.8,19.6 25.74,19.41 25.1,19.61 25.75,19.79 v25.8,19.6 | v33.5,20.1 33.69,20.04 33.5,19.4 33.31,20.04 v33.5,20.1 | v80.6,44.7 80.67,44.51 80.03,44.29 80.44,44.82 v80.6,44.7 | v31.8,48 31.74,47.81 31.1,48 31.74,48.19 v31.8,48 | v58.3,14.7 58.44,14.56 57.98,14.08 58.1,14.74 v58.3,14.7 | v28.6,42.8 28.66,42.99 29.3,42.8 28.66,42.61 v28.6,42.8 | v29.8,39.9 30,39.87 29.89,39.21 29.62,39.82 v29.8,39.9 | v29.8,39.9 29.61,39.96 29.8,40.6 29.99,39.96 v29.8,39.9 | v26.1,41.9 26.29,41.84 26.1,41.2 25.91,41.84 v26.1,41.9
  Top 0.406: v35.2,34 35.06,34.14 35.52,34.62 35.4,33.96 v35.2,34 | v36.7,33.5 36.58,33.66 37.12,34.06 36.89,33.43 v36.7,33.5 | v35.8,21.5 35.61,21.56 35.8,22.2 35.99,21.56 v35.8,21.5 | v42,41 42.19,40.94 42,40.3 41.81,40.94 v42,41 | v45,39 45.17,39.09 45.49,38.51 44.91,38.83 v45,39 | v50.8,37.7 50.95,37.57 50.5,37.07 50.6,37.73 v50.8,37.7 | v48.1,36.1 47.91,36.16 48.1,36.8 48.29,36.16 v48.1,36.1 | v36.7,8.6 36.51,8.66 36.7,9.3 36.89,8.66 v36.7,8.6 | v81.1,41.2 81,41.38 81.59,41.7 81.28,41.1 v81.1,41.2 | v70.8,33.4 70.99,33.34 70.8,32.7 70.61,33.34 v70.8,33.4 | v50.8,9.9 50.86,9.71 50.23,9.49 50.64,10.02 v50.8,9.9
  Top 0.5: C36.2 v21.6,26.2 | IC4.2 81.05,31.55 v80.8,31.8 | IC4.1 80.61,30.29 v80.2,30.7 | C20.2 v33.4,43.4 | IC4.11 75.39,41.72 v75.9,41.2 | IC4.19 75.45,31.55 v75.9,32 | C43.2 v4.3,32.5 | C45.2 v7.3,17.1 | v22.4,3.6 23.52,3.6 C44.2 | v21.6,26.2 21.45,26.23 21.6,26.9 21.75,26.23 v21.6,26.2 | v80.8,31.8 80.88,31.93 81.46,31.55 80.78,31.65 v80.8,31.8 | v80.2,30.7 80.31,30.8 80.76,30.29 80.14,30.56 v80.2,30.7 | v33.4,43.4 33.43,43.55 34.1,43.4 33.43,43.25 v33.4,43.4 | v75.9,41.2 75.77,41.12 75.41,41.7 75.98,41.33 v75.9,41.2 | v75.9,32 75.97,31.86 75.36,31.55 75.78,32.09 v75.9,32 | v4.3,32.5 4.1,32.55 4.3,33.34 4.5,32.55 v4.3,32.5 | v22.4,3.6 22.45,3.8 23.24,3.6 22.45,3.4 v22.4,3.6 | v7.3,17.1 7.35,17.3 8.14,17.1 7.35,16.9 v7.3,17.1
  Top 0.61: R40.1 v60.9,18.7 | C27.2 v60.9,20.2 | C8.2 v58.8,4.6 | R14.1 v70.6,28.7 | C30.2 v69.6,17 | C31.2 v71.6,17 | C29.2 v73.7,17.2 | U3.2 75.46,23.04 v75.8,22.7 | C4.2 v34.8,40.8 | C3.2 v36.5,40.8 | C5.2 34.2,21.9 v34.2,21.6 | C19.2 v70,41.4 | C28.2 v67.9,2.4 | C7.2 v63.55,6.2 | C37.2 v38.7,42.5 | C40.2 v22.6,7.1
  Bottom 0.406: v36.7,28.4 36.7,28.6
  pour Bottom (rank 3): 0.7,49.1 81.4,49.1 81.4,28.7 76.3,28.7 76.4,0.3 0.7,0.3
GNDA
  Bottom 0.61: R42.2 79.5,2.4 79.6,2.5
  pour Bottom: 93.8,1.6 78.8,1.6 78.7,27.5 93.8,27.5
GNDIO  (via drill 0.5)
  Top 0.61: C17.2 v84.7,47.6
  pour Bottom: 82,49.4 97.4,49.4 97.4,28.4 82,28.4
LED_GREEN
  Top 0.3: R12.2 88.44,30.66 89,30.1 91,30.1 91.8,30.1 96.5,30.1 97.1,30.7 97.1,32.69 J2.6
  Bottom 0.5: C12.1 95.78,34.01 J2.6
LED_RED
  Top 0.3: R35.2 88.34,33.16 90,31.4 95.75,31.4 J2.7
  Bottom 0.5: C11.1 95.76,31.41 J2.7
N$1
  Top 0.254: IC5.1 78.79,5.49 R1.1
N$2
  Top 0.254: IC2.- 83.04,3.76 82.3,4.5 82.3,5.6 81.6,6.3 81.6,7.14 IC5.2
N$3
  Top 0.254: IC2.+ 83.04,6.46 82.5,7 82.5,8.1 81.4,9.2 78.4,9.2 78.1,8.9 77.87,8.67 R1.2
N$4
  Top 0.406: IC2.AC1 91.26,6.46 arc90 92,7.2 arc-90 92.94,8.14 X1.4
N$5
  Top 0.406: IC2.AC2 91.94,3.76 arc-90 92.4,3.3 92.4,3.2 arc90 92.7,2.9 94.86,2.9 arc90 X1.5
N$6
  Top 0.254: IC5.3 78,10.57 R2.1
N$7
  Top 0.254: IC3.+ 83.44,13.06 82.4,14.1 82.1,14.4 78.8,14.4 77.9,13.5 77.9,13.4 77.9,12.43 R2.2
N$8
  Top 0.254: IC3.- 82.44,10.36 82.2,10.6 82.2,11.62 IC5.4
N$9
  Top 0.406: X1.3 93.62,13.22 arc90 93.3,12.9 93.3,10.7 arc-90 92.96,10.36 IC3.AC2
N$10
  Top 0.208: U1.8 33.12,35.88 32.6,36.4 32.31,36.4 R15.2
N$11
  Top 0.208: U1.7 33.92,35.78 33.8,35.9 33.8,36.3 33.6,36.5 33.2,36.5 32.7,37 32.7,39.88 Q1.3 31.55,42.77 C1.1
N$12
  Top 0.208: Q1.1 28.15,38.86 R15.1
  Top 0.254: C2.1 26.5,38.98 Q1.1
N$13
  Top 0.61: X1.2 93.9,18.3 arc90 92.5,16.9 92.5,14.1 arc-90 91.46,13.06 IC3.AC1 88.24,13.06 arc-90 87.6,13.7 87.6,15.9 arc90 87,16.5 85.4,16.5 arc-90 84.8,17.1 84.8,21.8 arc90 83.7,22.9 80.1,22.9 arc-90 79.12,23.88 K2.10
N$14
  Top 0.208: R8.1 38.98,9.08 39.2,9.3 39.2,9.5 38.8,9.9 U9.4
N$15
  Bottom 0.61: R10.2 95.01,23.4 X1.1
N$16
  Top 0.61: U3.3 73.44,25.34 arc90 73.4,25.6 73.4,26.1 arc-90 73.94,26.44 D1.A 80.16,26.44 arc-90 K2.9
N$17
  Top 0.208: IC4.16 69.56,35.37 68.4,34.2 68.4,33.05 R48.2
N$18
  Bottom 0.61: K2.6 90.16,24.94 90.2,24.9 90.55,24.55 R10.1 90.55,20.35 90.5,20.3 90.06,19.86 K2.5
N$19  (via drill 0.5)
  Top 0.3: U2.3 48.16,10.77 47.6,10.2 47.6,10.12 C35.1 48.27,8.3 v48.5,8.1 | v48.5,8.1 48.27,7.99 47.99,8.58 48.6,8.33 v48.5,8.1
  Bottom 0.3: v48.5,8.1 49,7.6 50.4,7.6 50.8,8 50.9,8.1 56.4,8.1 57.1,8.8 57.45,9.15 R53.1 | v48.5,8.1 48.73,8.2 48.99,7.61 48.4,7.87 v48.5,8.1
N$20
  Bottom 0.305: R53.2 59.15,7.7 D2.2
N$21
  Top 0.208: SV1.1 30.19,26.26 R43.2
N$22  (via drill 0.5)
  Top 0.208: U1.11 30.04,32.36 29.1,33.3 29.1,34.4 v29.6,34.9 | v38.8,39.6 40.5,37.9 40.5,37.2 41.2,36.5 41.8,36.5 43.7,34.6 44.9,34.6 45.5,34.6 51.7,34.6 52.4,35.3 52.4,37.1 53,37.8 53,40.7 53,40.8 53,42.95 R52.1 | v29.6,34.9 29.7,34.62 29.11,34.41 29.32,35 v29.6,34.9 | v38.8,39.6 39.08,39.7 39.3,39.1 38.7,39.32 v38.8,39.6
  Bottom 0.208: v29.6,34.9 30.6,34.9 30.8,35.1 32.5,35.1 36.5,39.1 37.3,39.1 37.6,39.4 37.8,39.6 v38.8,39.6 | v29.6,34.9 29.73,35.17 30.3,34.9 29.73,34.63 v29.6,34.9 | v38.8,39.6 38.67,39.33 38.1,39.6 38.67,39.87 v38.8,39.6
N$23
  Bottom 0.305: D2.3 61.5,8.7 60.7,9.5 60.7,11.3 60.3,11.7 58.4,11.7 58.3,11.6 58.3,11.9 B1.+1
N$24
  Top 0.208: R34.2 68.2,36.3 68.8,36.9 69.81,37.91 IC4.14
N$25
  Top 0.208: U7.10 29.17,18.67 29.17,20.32 R30.1
N$26  (via drill 0.5)
  Top 0.208: v55.6,11.5 55.1,12 53.8,12 U2.7 | v55.6,11.5 55.32,11.4 55.1,11.99 55.7,11.78 v55.6,11.5
  Bottom 0.208: R36.2 47.7,8.9 48.8,8.9 49.5,8.2 50.3,8.2 50.6,8.5 50.7,8.6 55.2,8.6 55.6,9 55.6,10 v55.6,11.5 | v55.6,11.5 55.87,11.37 55.6,10.8 55.33,11.37 v55.6,11.5
N$27
  Top 0.208: U6.7 11.99,38.59 9.1,35.7 9,35.6 9,33.6 11,31.6 11,28.3 11.7,27.6 13.3,26 14.1,26 15.1,25 15.4,24.7 18.35,24.7 R25.2
N$28
  Top 0.208: U8.3 46.91,17.46 R39.2 46.2,17.25 46.2,15.3 46.2,15.1 44.8,14.1 44.8,12.4 44.45,12.45 R38.2
N$29
  Top 0.208: U6.6 10.6,40 10.6,39.9 10.7,39.8 10.7,37.9 8.6,35.8 8.6,33.4 10.6,31.4 10.6,28.1 11.5,27.2 13.1,25.6 13.9,25.6 14.6,24.9 14.6,24.35 R27.2
N$30
  Top 0.208: U6.5 9.48,37.28 8.2,36 8.2,33.2 10.2,31.2 10.2,27.9 10.9,27.2 11.4,26.7 12.9,25.2 13.7,25.2 14,24.9 14,23.3 14.1,23.2 14.4,22.9 17.1,22.9 17.2,23 R28.2
N$31
  Top 0.208: R29.2 67.7,40.24 68.06,40.24 68.1,40.2 68.2,40.1 68.3,40 72.2,40 72.6,40.4 73.42,40.4 IC4.12
N$32
  Top 0.208: IC4.17 72.7,34.09 72,34.8 69.7,34.8 68.9,34 68.9,32.7 67.8,31.6 67.8,29.95 R51.2
N$33
  Top 0.208: R41.1 24.3,21.4 25,20.7 25.1,20.6 26.4,20.6 26.8,20.2 26.8,19.3 26.2,18.7 25.5,18.7 25.4,18.6 25.36,18.56 U7.13
N$35
  Top 0.61: K2.2 81.66,20.74 arc90 80.9,21.5 77.7,21.5 arc90 76.76,20.56 D1.C 75.2,20.38 C29.1 71.62,20.38 C31.1 C30.1 69.85,20.65 R44.2
N$36
  Top 0.208: U2.1 47.47,13.3 Q2.1
  Bottom 0.208: C33.1 48.5,12.8 48.1,13.2 47.57,13.2 Q2.1
N$37
  Top 0.208: U1.24 38.72,25.68 39.8,24.6 40.75,24.6 R45.1
N$38
  Top 0.254: R45.2 LED1.C
N$39
  Top 0.3: LED2.C 28.55,48.1 R46.2
N$40
  Top 0.208: U2.2 47.6,12.04 Q2.2
  Bottom 0.208: C34.1 46.93,11.3 Q2.2
N$41
  Top 0.208: IC4.15 69.48,36.63 R50.2
N$42
  Top 0.208: IC4.13 68.97,39.17 68.7,38.9 68.6,38.8 R49.2
N$43
  Top 0.5: SV2.1 SV2.2 19.43,29.12 R55.2 21.57,29.05 C36.1
N$46
  Top 0.61: C37.1 41.48,44.38 R56.2 41.52,44.47 SV3.2 SV3.1
NRLF_IRQ
  Top 0.208: U6.8 11.97,41.13 10.5,42.6 8.8,42.6 8.2,42 8.2,36.6 7.9,36.3 7.8,36.2 7.8,33 9.8,31 9.8,27.7 11.1,26.4 11.2,26.3 12.6,24.9 12.6,24.15 R54.2
PI_3V3
  Top 0.813: SK1.P1-1 59.8,6.26 R6.1
  Bottom 0.406: SK1.P1-17
  Bottom 0.5: SK1.P1-1 55.6,4.97 55.6,2.1 55,1.5 38.6,1.5 38.5,1.5 37.85,2.2 37.85,5.04 SK1.P1-17
  pour Top (isolate 0.208): 1.5,35.5 1.5,9.4 6.9,9.4 6.9,16.5 19.4,16.5 19.4,0.6 38.2,0.6 38.2,7.2 34.7,7.2 34.7,5.2 33.8,5.2 33.8,2.1 21.3,2.1 21.3,18.4 18,18.4 16.3,20.1 9.3,20.1 8.4,21 8.4,35.5
PI_AVR  (via drill 0.5)
  Top 0.208: v37.7,25.1 37.7,25.8 | 37.7,25.8 37.9,26 37.9,26.85 U1.23 | v37.2,19.3 37.2,18.6 | 37.2,18.6 37.4,18.4 37.5,18.3 37.5,17.6 37.5,17.03 U9.12 | 37.2,18.6 37.47,19.17 v37.2,19.3 | 37.2,18.6 36.93,19.17 v37.2,19.3 | 37.7,25.8 37.43,25.23 v37.7,25.1 | 37.7,25.8 37.97,25.23 v37.7,25.1
  Bottom 0.208: v37.2,19.3 37.2,22.6 37.7,23.1 37.7,24.9 v37.7,25.1 | v37.2,19.3 36.93,19.43 37.2,20 37.47,19.43 v37.2,19.3 | v37.7,25.1 37.97,24.97 37.7,24.4 37.43,24.97 v37.7,25.1
PI_GPIO0
  Bottom 0.208: R36.1 45.3,7.37 SK1.P1-11
PI_GPIO1
  Top 0.208: U9.3 37.6,11.73 37.6,10.9 38.3,10.2 38.3,8.3 38.4,8.2 38.9,7.7 39.3,7.7 40.3,6.7 40.3,5.2 40.6,4.9 43,4.9 43.1,4.8 44.17,3.73 SK1.P1-12
PI_GPIO3  (via drill 0.5)
  Top 0.208: v32.5,21.4 32,20.9 31.7,20.6 31.7,19.3 32,19 32.5,18.5 32.5,14.9 32.4,14.8 32.4,10.6 31.3,9.5 31.3,8.5 31.9,7.9 37.6,7.9 37.8,7.7 38.91,6.58 SK1.P1-15 | v32.5,21.4 32.6,21.12 32.01,20.91 32.22,21.5 v32.5,21.4
  Bottom 0.208: v32.5,21.4 32.5,23.6 32.7,23.8 32.7,25.23 R18.2 32.45,25.48 32.45,27.05 33.1,27.7 33.5,27.7 33.6,27.8 33.6,27.99 U5.1 | v32.5,21.4 32.23,21.53 32.5,22.1 32.77,21.53 v32.5,21.4
PI_GPIO4
  Top 0.208: U7.8 31.71,15.29 30.7,14.28 30.7,13.5 31.1,13.1 31.1,10.3 30.7,9.9 30.7,8.3 31.5,7.5 33.1,7.5 34.6,7.5 37.2,7.5 38,6.7 38,4.84 SK1.P1-16
PI_GPIO5  (via drill 0.5)
  Top 0.208: v10.9,21.1 R57.1 | v10.9,21.1 10.63,21.23 10.9,21.8 11.17,21.23 v10.9,21.1
  Bottom 0.208: SK1.P1-18 36.58,1.18 35.8,0.4 19.6,0.4 19.1,0.9 19.1,15.8 18.7,16.2 12.6,16.2 11,17.8 10.9,17.9 v10.9,21.1 | v10.9,21.1 11.17,20.97 10.9,20.4 10.63,20.97 v10.9,21.1
PI_GPIO6
  Top 0.208: SK1.P1-22 31.5,2.4 31,1.9 24.6,1.9 22,1.9 21,2.9 21,13.9 20.7,14.2 | 20.7,14.2 20.7,14.3 | 20.7,14.3 20.7,14.2 | 20.7,14.2 20.7,14.3 | 20.7,14.3 20.7,16.7 20,17.4 19.4,18 17.8,18 15.9,19.9 9.2,19.9 7.8,21.3 7.8,22.6 8.2,23 12.05,23 R54.1
PI_GPIO7
  Top 0.208: SK1.P1-7 48.3,7.24 48.26,7.24 47.4,8.1 43.9,8.1 43.4,8.6 43.4,10.5 43.8,10.9 43.85,10.95 R38.1
PI_MISO
  Top 0.208: SK1.P1-21 29.17,8.59 U7.5 29.17,12.53 29,12.7 29,13.6 28,14.6 23,14.6 22.3,15.3 22.3,17.3 22.3,17.5 20.8,19 20,19.8 18.7,19.8 18.5,20 18.5,21.35 R25.1
PI_MOSI
  Top 0.208: SK1.P1-19 32.77,5 28.1,5 27.7,5.4 27.7,7.6 26.63,8.67 U7.3 26.6,12.03 26.6,13 26.6,13.4 26.3,13.7 22.7,13.7 21.5,14.9 21.5,17 21.5,17.1 20.4,18.2 19.7,18.9 19.6,19 18.2,19 16.7,20.5 15.6,21.6 15.3,21.9 R27.1
PI_SCK
  Top 0.208: SK1.P1-23 28.9,6.32 28.9,8 27.9,9 U7.4 27.9,13.5 27.3,14.1 22.9,14.1 21.9,15.1 21.9,17.2 21.9,17.3 21.5,17.7 20.6,18.6 19.8,19.4 18.4,19.4 17.3,20.5 17.1,20.7 17.1,21.95 R28.1 17.2,22
PI_SCL
  Top 0.208: 53.1,10.7 53.7,10.7 | 53.7,10.7 53.84,10.7 | U2.6 53.7,10.7 | SK1.P1-5 51.81,7.51 52.2,7.9 52.2,10.1 52.7,10.6 53.6,10.6 U2.6 | U2.6 55.34,10.77 56.1,10 59,10 59.5,10.5 59.5,15.3 59.2,15.6 57,15.6 56.4,15 52.2,15 51.3,15.9 51.3,18.9 51,19.2 50.6,19.2 50.2,18.8 49.37,18.8 U8.2
PI_SDA
  Top 0.208: SK1.P1-3 54.34,6.26 52.7,7.9 52.7,9.2 53.1,9.6 53.5,9.6 | 53.5,9.6 54.09,9.6 54.2,9.49 55.76,9.49 59.3,9.49 59.9,10.1 60,10.2 60,15.5 59.4,16.1 56.8,16.1 56.1,15.4 52.5,15.4 51.7,16.2 51.7,19.1 50.8,20 U8.1 | U2.5 53.7,9.49 53.5,9.6
PI_SRX
  Top 0.208: SK1.P1-10 46.67,3.73 45.4,5 43.5,5 43,5.5 42.9,5.6 42.9,6.8 41.9,7.8 41.4,7.8 41,8.2 41,9.25 R8.2
PI_STX
  Top 0.208: U9.5 40.07,10.53 40.4,10.2 41.5,10.2 41.8,9.9 41.8,9.2 42.3,8.6 42.6,8.6 43.6,7.6 47.2,7.6 48,6.8 48,5 SK1.P1-8
R_BUZZER
  Top 0.3: IC4.3 86.12,32.83 88.2,34.9 89.6,34.9 89.9,34.6 91.25,34.6 R11.1
R_GREEN
  Top 0.3: IC4.5 85.86,35.37 86.2,35.7 R12.1
R_RED
  Top 0.3: IC4.7 85.2,37.91 85.4,38.1 85.54,38.24 R35.1
RF_VCC
  Top 0.5: R33.1 2.4,35 R33.1 | 2.47,35.02 R33.1
  Top 0.61: U6.2 2.4,39.13 R33.1 2.42,35.27 C43.1
  Bottom 0.5: C42.1 U6.2
  Bottom 0.61: R22.2 2.28,40.68 2.7,41.1 4.37,41.1 U6.2
RF_VXX
  Bottom 0.61: R23.1 4.4,36.33 U6.1 2.42,38.59 R22.1
RFID_BUZZ
  Top 0.208: R51.1 53.45,29.3 53.1,29.3 52,30.5 52,31.5 51.3,32.2 46.5,32.2 46.2,31.9 46.1,31.8 46.1,31 45.8,30.7 44.4,30.7 44.1,30.4 41.6,30.4 41.24,30.76 U1.28
RFID_D0
  Top 0.208: R29.1 56,39.25 56,31 54.8,29.8 53.3,29.8 52.4,30.7 52.4,31.7 51.5,32.6 46.9,32.6 46.5,32.6 46.2,32.6 42.5,32.6 42.3,32.8 41.7,33.4 41.14,33.96 U1.32
RFID_D1
  Top 0.208: U1.1 38.85,35.55 39.55,35.55 39.6,35.5 40.2,34.9 40.8,34.9 41.9,33.8 42,33.7 42.7,33 42.8,33 45.8,33 46.3,33 46.4,33 47.1,33 51.7,33 52.8,31.9 52.8,30.9 53.5,30.2 54.6,30.2 55.1,30.7 55.6,31.2 55.6,34.65 R34.1
RFID_GREEN  (via drill 0.5)
  Top 0.208: U1.9 32.74,33.96 v33.3,33.4 | v39.1,37.6 39.7,37 39.7,36.8 40.6,35.9 40.7,35.8 40.8,35.7 41.4,35.7 43.3,33.8 45.3,33.8 45.9,33.8 47.5,33.8 52,33.8 R50.1 | v33.3,33.4 33.02,33.3 32.8,33.9 33.4,33.68 v33.3,33.4 | v39.1,37.6 39.38,37.7 39.59,37.1 39,37.32 v39.1,37.6
  Bottom 0.208: 33.3,34.1 33.1,34.3 33.1,34.5 36.2,37.6 36.4,37.8 36.5,37.9 37.3,37.9 37.6,37.6 v39.1,37.6 | 33.3,34.1 v33.3,33.4 | 33.3,34.1 33.03,33.53 v33.3,33.4 | 33.3,34.1 33.57,33.53 v33.3,33.4 | v39.1,37.6 38.97,37.33 38.4,37.6 38.97,37.87 v39.1,37.6
RFID_RED  (via drill 0.5)
  Top 0.208: v29.9,33.6 30,33.5 30.3,33.2 31.59,33.2 U1.10 | R49.1 53.9,38.75 53.9,37.8 53.6,37.5 52.8,36.7 52.8,35.1 52.4,34.7 51.9,34.2 47.7,34.2 45.7,34.2 45.1,34.2 43.5,34.2 41.6,36.1 41,36.1 40.8,36.3 40.1,37 40.1,37.7 39.2,38.6 v38,38.6 | v38,38.6 38.13,38.87 38.7,38.6 38.13,38.33 v38,38.6 | v29.9,33.6 30.16,33.75 30.47,33.2 29.85,33.31 v29.9,33.6
  Bottom 0.208: v38,38.6 36.6,38.6 36.1,38.1 32.7,34.7 31,34.7 v29.9,33.6 | v38,38.6 37.87,38.33 37.3,38.6 37.87,38.87 v38,38.6 | v29.9,33.6 29.8,33.88 30.39,34.09 30.18,33.5 v29.9,33.6
RFID_SPARE
  Top 0.208: U1.2 37.92,36.22 38.2,36.5 39.3,36.5 40.3,35.5 40.5,35.3 41.2,35.3 42.5,34 43.1,33.4 43.2,33.4 45.7,33.4 46.1,33.4 47.3,33.4 51.9,33.4 52,33.3 53.1,32.2 53.3,32 53.3,31.95 R48.1
RFID_SW
  Top 0.254: U4.6 78.24,45.24 78.1,45.1 78,45 78,43.7 77.7,43.4 77.64,43.34 U4.3
  Top 0.3: U4.3 75.13,43.34 R17.1
RFID_VCC
  Top 0.5: R20.2 R19.2 94.54,45.43 J2.1 | R20.2 86.19,45.43 R21.2 85.05,45.45 84.1,44.5 82.19,44.5 R24.1 | R20.2 88.37,47.47 C17.1
  Top 0.61: U4.4 81.34,43.34 82.1,44.1 82.1,44.49 R24.1
  Bottom 0.5: C10.1 J2.1
RFID_VCCEN  (via drill 0.5)
  Top 0.208: U4.1 76.69,46.19 v77.1,46.6 | v77.1,46.6 77.24,46.34 76.69,46.03 76.81,46.66 v77.1,46.6
  Bottom 0.208: v77.1,46.6 69.35,46.6 R52.2 | v77.1,46.6 76.97,46.33 76.4,46.6 76.97,46.87 v77.1,46.6
RFID_VCCSU
  Top 0.61: R16.1 75.14,45.05 R17.2 75.16,44.29 U4.2
S_RX
  Top 0.208: U9.11 38.8,19.49 R7.1
S_RX1
  Top 0.208: R32.1 28.3,19.1 28,18.8 27.9,18.7 U7.11
S_TX
  Top 0.208: R9.1 40.64,19.34 40.1,18.8 40.1,17.03 U9.10
S_TX1
  Top 0.208: R31.1 26.45,21.45 27.3,20.6 27.3,19.1 26.7,18.5 26.7,17.47 U7.12
SPARE_INPUT
  Top 0.3: IC4.4 86.59,34.09 87.2,34.7 87.3,34.8 88.7,36.2 89.9,37.4 90.2,37.7 90.6,38.1 90.67,38.17 R19.1 93.25,40.35 93.5,40.1 94.6,39 95.73,39 J2.4 95.77,39.1
  Bottom 0.5: C14.1 95.74,39.01 J2.4
TMP_A0
  Top 0.208: U8.7 57.41,18.73 R40.2
VCC  (via drill 0.5)
  Top 0.406: 41.98,37.95 C38.1
  Bottom 0.406: SV1.2 23.24,26.26 v22.8,25.8 | R13.2 v25.1,34 | v22.8,25.8 22.72,25.98 23.33,26.26 22.97,25.69 v22.8,25.8 | v25.1,34 25.16,34.19 25.8,34 25.16,33.81 v25.1,34
  pour Top (rank 3): 1.8,49 1.8,2.1 75.2,1.7 75.2,19.4 70.4,19.3 70.4,29.7 69.2,29.8 79.5,30 79.5,33.4 82.9,33.4 82.9,49.1 75.3,49.1